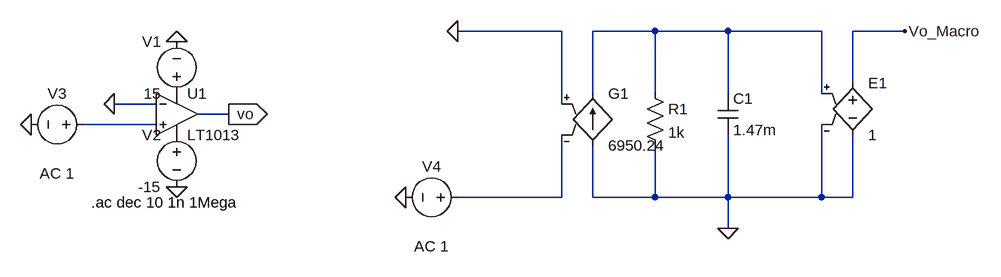
[diagram p0: schematic Q1.asc]
Q1.asc, the LTspice schematic file:
Version 4
SHEET 1 1364 680
WIRE 688 64 528 64
WIRE 832 64 736 64
WIRE 944 64 832 64
WIRE 1088 64 944 64
WIRE 1216 64 1136 64
WIRE 1136 144 1136 64
WIRE 736 160 736 64
WIRE 832 160 832 64
WIRE 944 160 944 64
WIRE 1088 160 1088 64
WIRE 64 176 0 176
WIRE 688 176 688 64
WIRE 176 192 128 192
WIRE 64 208 -48 208
WIRE 688 320 688 224
WIRE 688 320 528 320
WIRE 736 320 736 240
WIRE 832 320 832 240
WIRE 832 320 736 320
WIRE 944 320 944 224
WIRE 944 320 832 320
WIRE 1088 320 1088 208
WIRE 1088 320 944 320
WIRE 1136 320 1136 224
WIRE 1136 320 1088 320
WIRE 944 368 944 320
FLAG 96 304 0
FLAG 96 80 0
FLAG 176 192 vo
IOPIN 176 192 Out
FLAG 0 176 0
FLAG -128 208 0
FLAG 528 64 0
FLAG 448 320 0
FLAG 944 368 0
FLAG 1216 64 Vo_Macro
SYMBOL Opamps\\LT1013 96 128 R0
SYMATTR InstName U1
SYMBOL voltage 96 176 R180
WINDOW 0 24 96 Left 2
WINDOW 3 24 16 Left 2
WINDOW 123 0 0 Left 2
WINDOW 39 0 0 Left 2
SYMATTR InstName V1
SYMATTR Value 15
SYMBOL voltage 96 208 M0
WINDOW 123 0 0 Left 2
WINDOW 39 0 0 Left 2
SYMATTR InstName V2
SYMATTR Value -15
SYMBOL voltage -32 208 R90
WINDOW 0 -32 56 VBottom 2
WINDOW 3 32 56 VTop 2
WINDOW 123 60 56 VTop 2
WINDOW 39 0 0 Left 2
SYMATTR InstName V3
SYMATTR Value ""
SYMATTR Value2 AC 1
SYMBOL res 816 144 R0
SYMATTR InstName R1
SYMATTR Value 1k
SYMBOL cap 928 160 R0
SYMATTR InstName C1
SYMATTR Value 1.47m
SYMBOL voltage 544 320 R90
WINDOW 0 -32 56 VBottom 2
WINDOW 3 32 56 VTop 2
WINDOW 123 60 56 VTop 2
WINDOW 39 0 0 Left 2
SYMATTR InstName V4
SYMATTR Value ""
SYMATTR Value2 AC 1
SYMBOL g 736 144 R0
SYMATTR InstName G1
SYMATTR Value 6950.24
SYMBOL e 1136 128 R0
SYMATTR InstName E1
SYMATTR Value 1
TEXT -36 328 Left 2 !.ac dec 10 1n 1Mega

The netlist it stands for:
* Q1.asc
XU1 N002 0 P001 P002 vo LT1013  ; pins In+ In- V+ V- OUT
V1 P001 0 15
V2 P002 0 -15
V3 N002 0 AC 1
R1 N001 0 1k
C1 N001 0 1.47m
V4 N003 0 AC 1
G1 0 N001 0 N003 6950.24
E1 Vo_Macro 0 N001 0 1
.ac dec 10 1n 1Mega
.lib LTC.lib
.backanno
.end